# EAGLE schematic Lsensor (EAGLE 7.4.0)
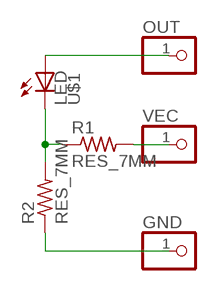
[diagram p0: schematic, sheet 1]

## Parts
GND  PINHD-1X1  [1X01]
OUT  PINHD-1X1  [1X01]
R1  RES_7MM  [0204/7]
R2  RES_7MM  [0204/7]
U$1  LED  [5MM]
VEC  PINHD-1X1  [1X01]

## Nets
N$1: R1.2 VEC.1
N$2: OUT.1 U$1.IN(A)
N$3: R1.1 R2.2 U$1.OUT(C)
N$4: GND.1 R2.1

## Library data of the parts
GND OUT VEC = Yamaguchi:PINHD-1X1: PIN HEADER
R1 R2 = Yamaguchi:RES_7MM
U$1 = Yamaguchi:LED